# EAGLE schematic ab_v11_panel (EAGLE 6.1)
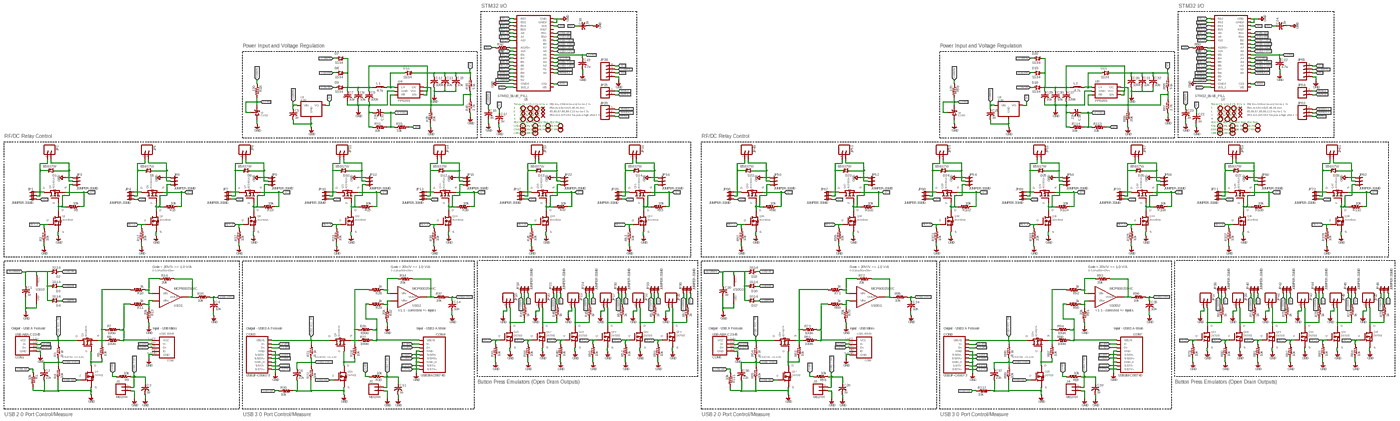
[diagram p0: schematic, sheet 1, overview]
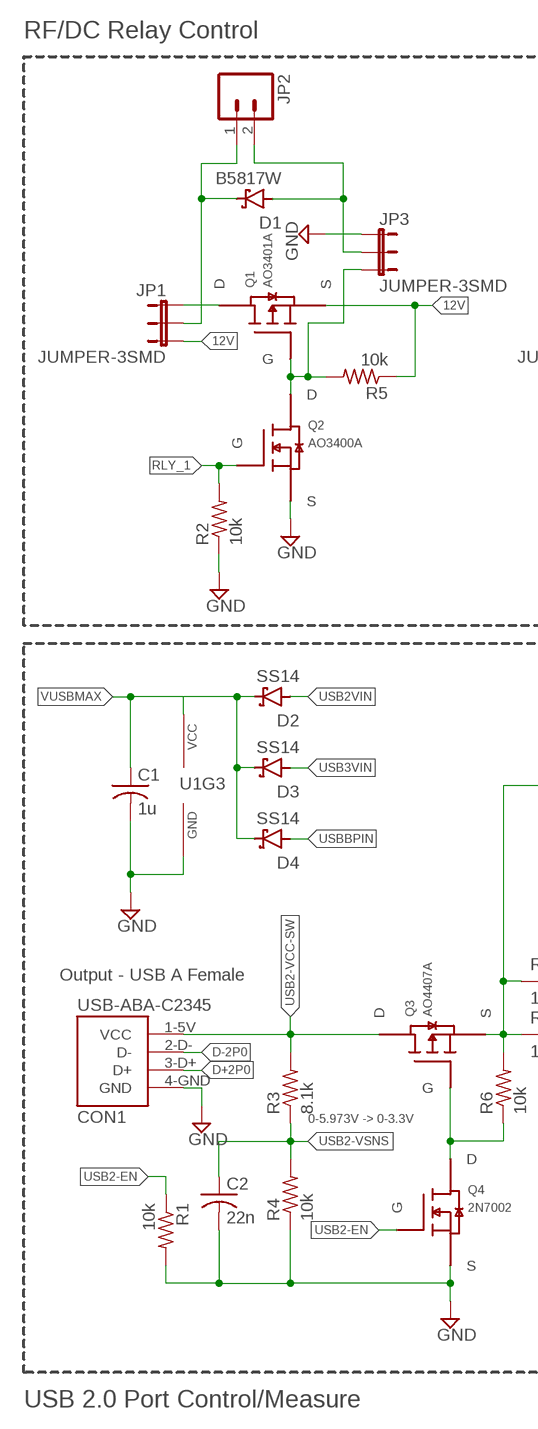
[diagram p1: schematic, sheet 1, part 1 of 4]
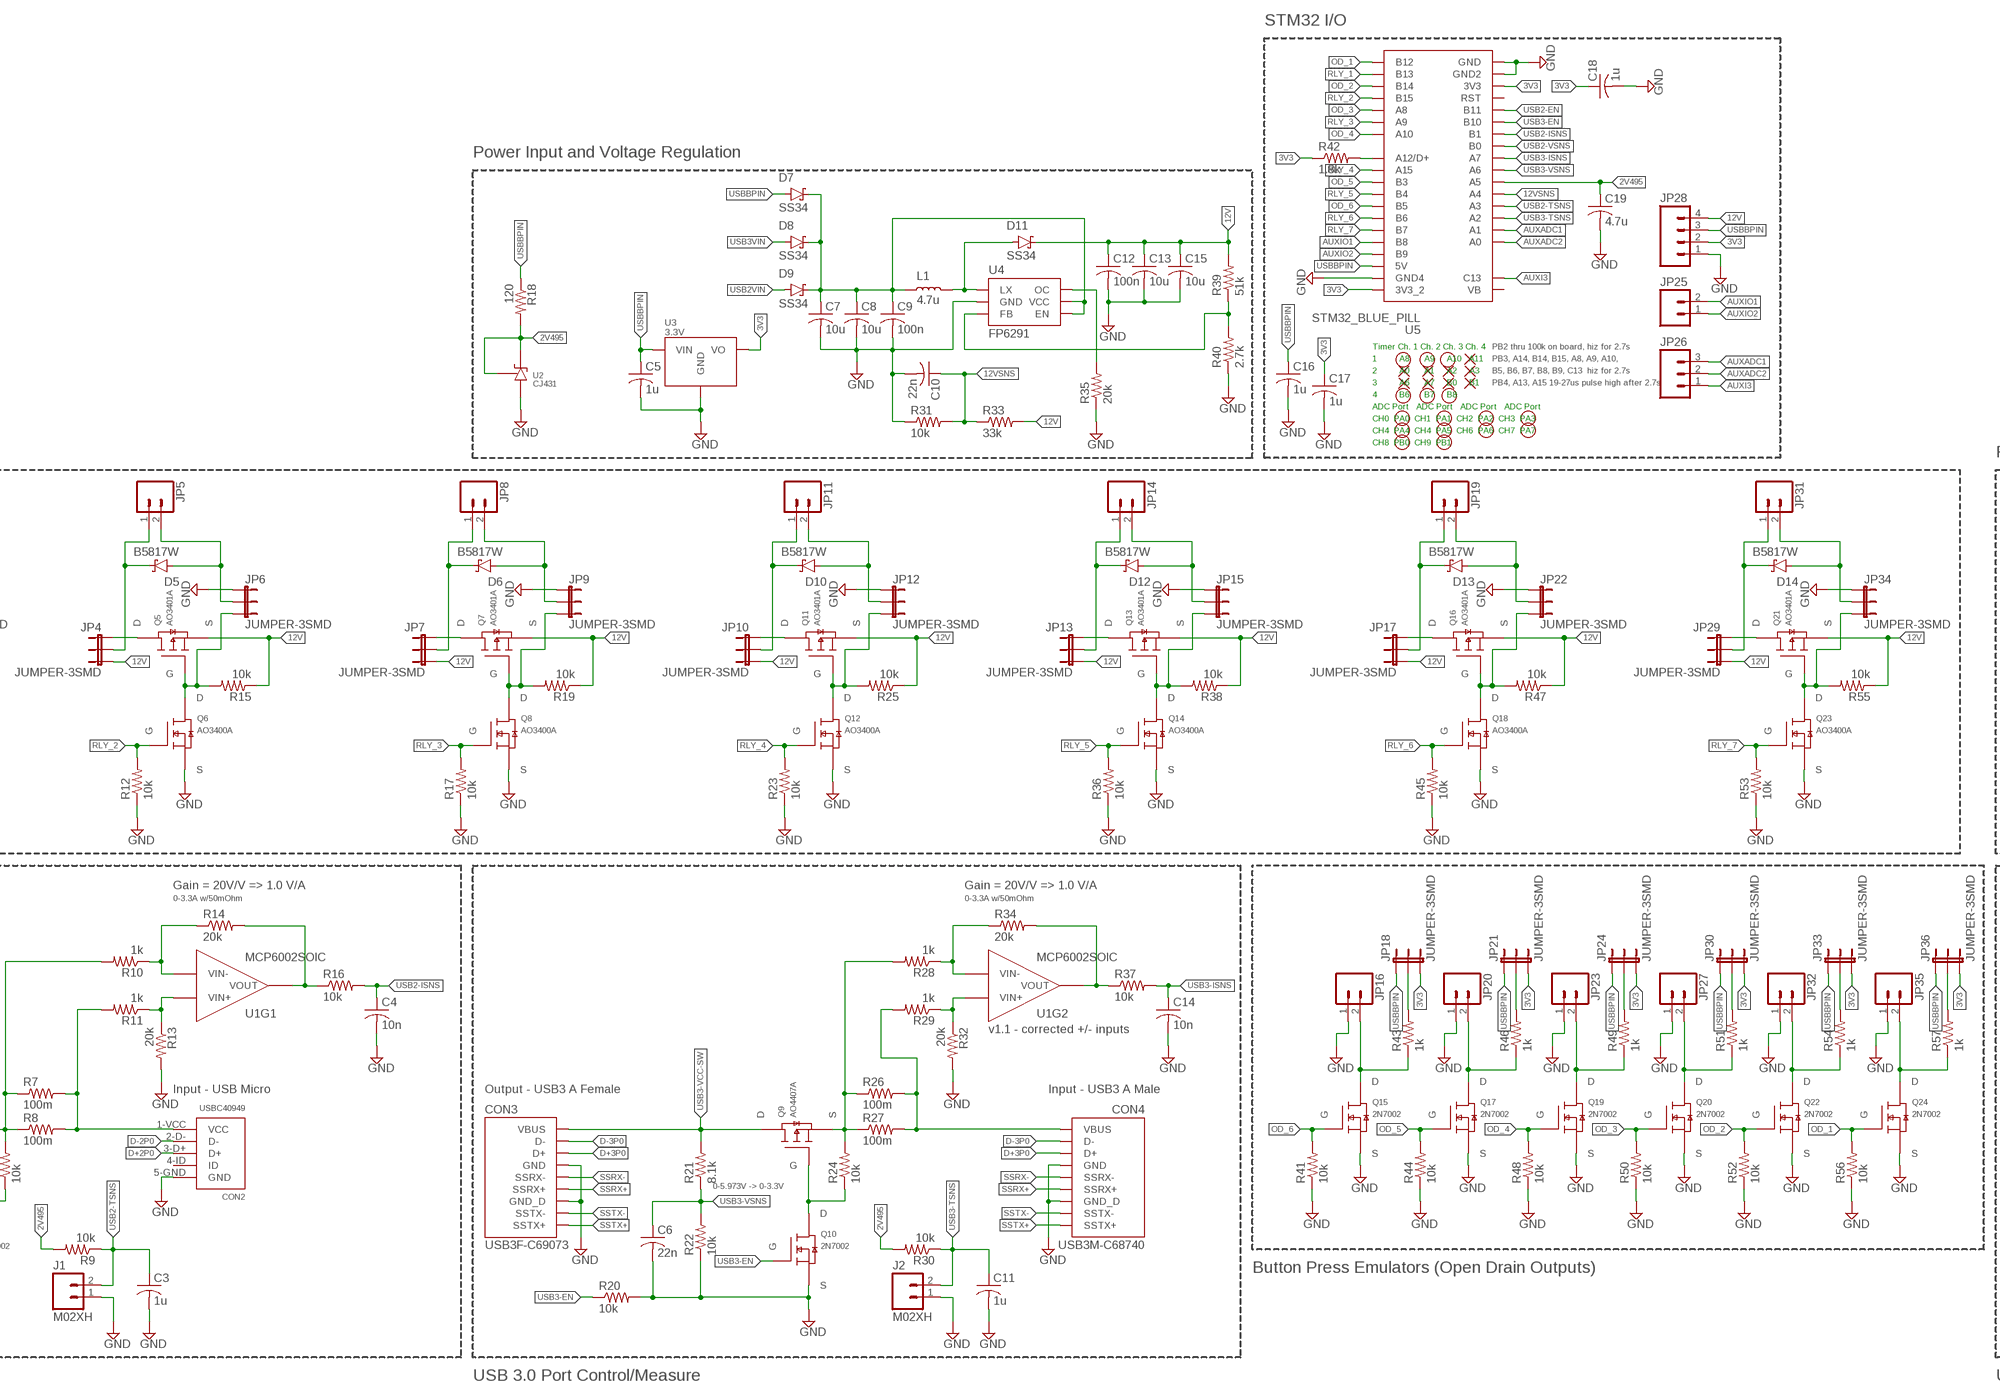
[diagram p2: schematic, sheet 1, part 2 of 4]
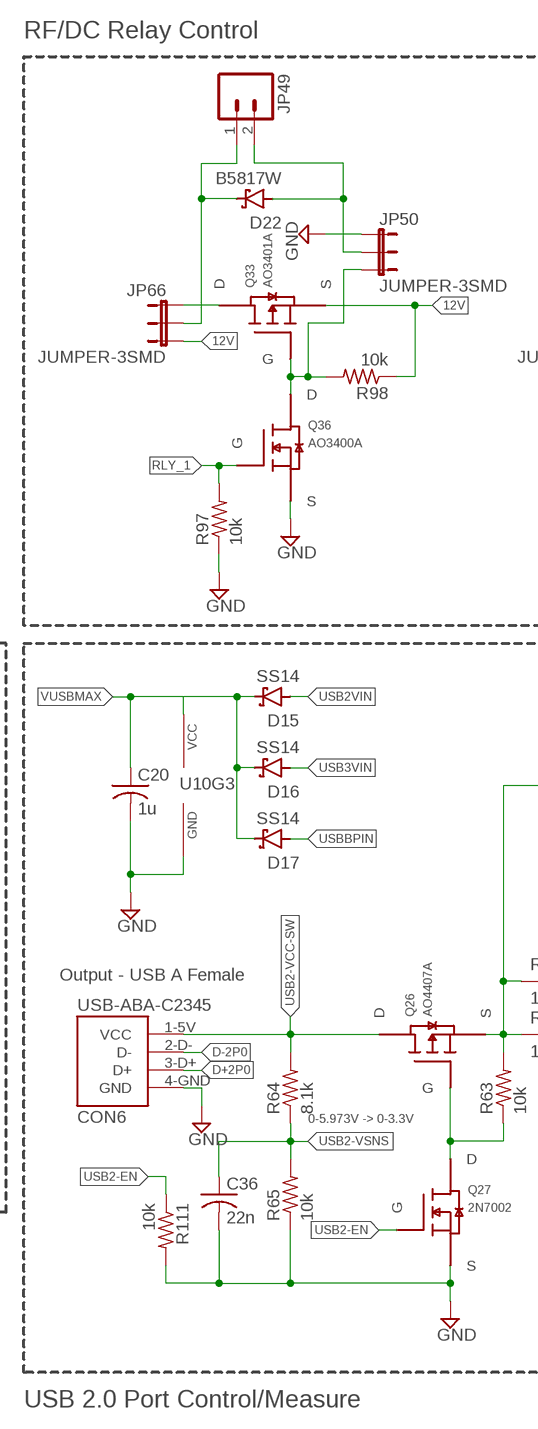
[diagram p3: schematic, sheet 1, part 3 of 4]
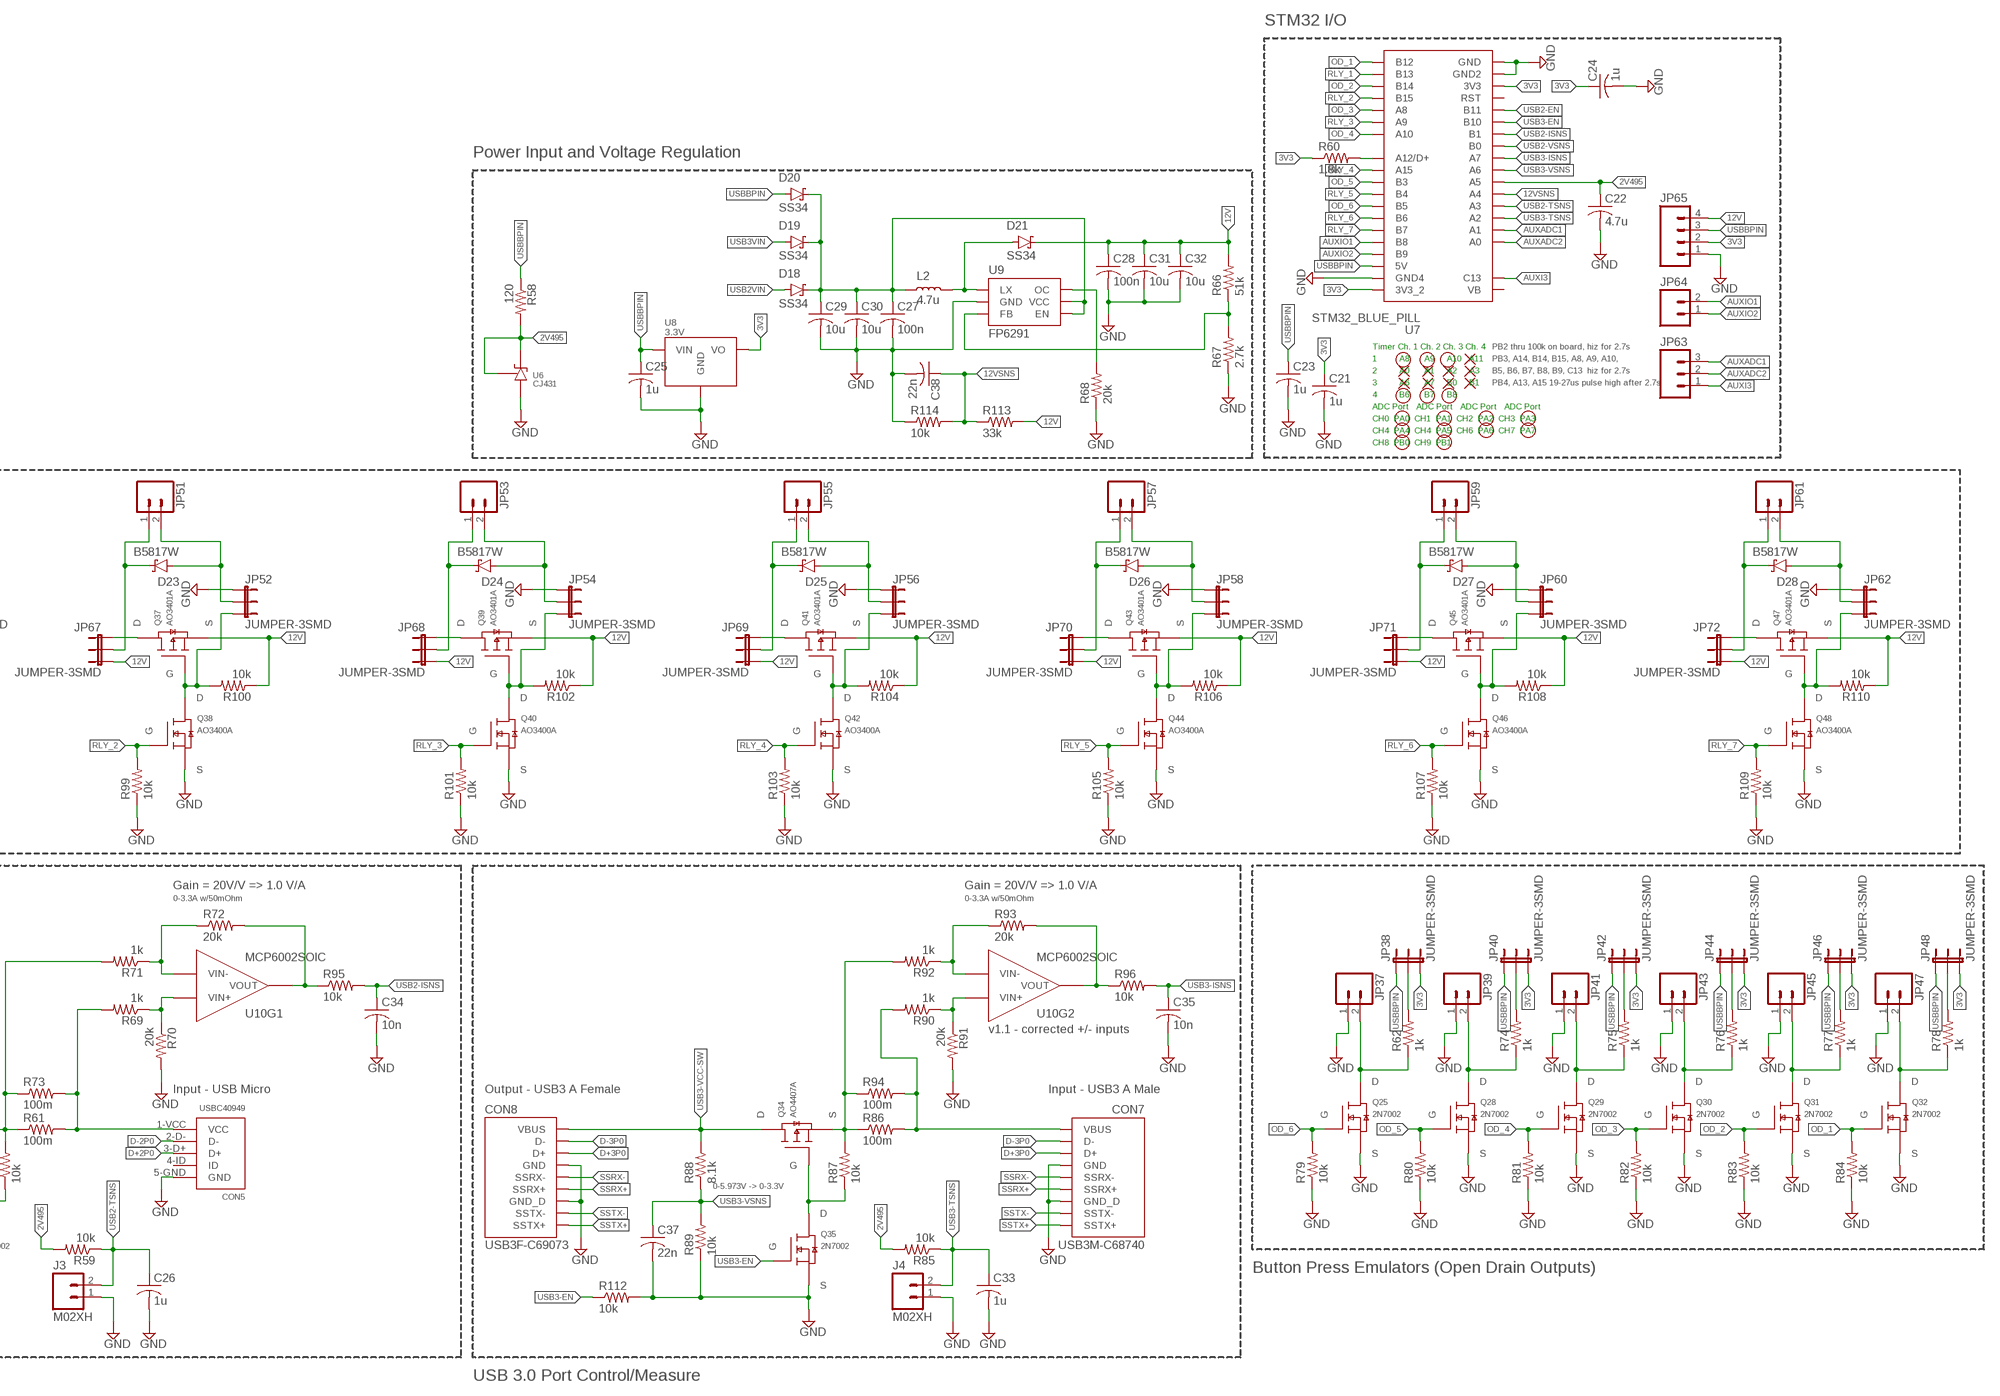
[diagram p4: schematic, sheet 1, part 4 of 4]

## Parts
C1  1u  C-USC0402  [C0402]
C2  22n  C-USC0402  [C0402]
C3  1u  C-USC0402  [C0402]
C4  10n  C-USC0402  [C0402]
C5  1u  C-USC0402  [C0402]
C6  22n  C-USC0402  [C0402]
C7  10u  C-USC0603  [C0603]
C8  10u  C-USC0603  [C0603]
C9  100n  C-USC0402  [C0402]
C10  22n  C-USC0402  [C0402]
C11  1u  C-USC0402  [C0402]
C12  100n  C-USC0402  [C0402]
C13  10u  C-USC0805  [C0805]
C14  10n  C-USC0402  [C0402]
C15  10u  C-USC0805  [C0805]
C16  1u  C-USC0402  [C0402]
C17  1u  C-USC0402  [C0402]
C18  1u  C-USC0402  [C0402]
C19  4.7u  C-USC0402  [C0402]
C20  1u  C-USC0402  [C0402]
C21  1u  C-USC0402  [C0402]
C22  4.7u  C-USC0402  [C0402]
C23  1u  C-USC0402  [C0402]
C24  1u  C-USC0402  [C0402]
C25  1u  C-USC0402  [C0402]
C26  1u  C-USC0402  [C0402]
C27  100n  C-USC0402  [C0402]
C28  100n  C-USC0402  [C0402]
C29  10u  C-USC0603  [C0603]
C30  10u  C-USC0603  [C0603]
C31  10u  C-USC0805  [C0805]
C32  10u  C-USC0805  [C0805]
C33  1u  C-USC0402  [C0402]
C34  10n  C-USC0402  [C0402]
C35  10n  C-USC0402  [C0402]
C36  22n  C-USC0402  [C0402]
C37  22n  C-USC0402  [C0402]
C38  22n  C-USC0402  [C0402]
CON1  USB-ABA-C2345  [USB_A_C2345]
CON2  USBC40949  [MICRO_USB-B_C40949]
CON3  USB3F-C69073  [USB3-F-C69073]
CON4  USB3M-C68740  [USB3-M-C68740]
CON5  USBC40949  [MICRO_USB-B_C40949]
CON6  USB-ABA-C2345  [USB_A_C2345]
CON7  USB3M-C68740  [USB3-M-C68740]
CON8  USB3F-C69073  [USB3-F-C69073]
D1  B5817W  PMEG3020ER  [SOD123W]
D2  SS14  DIODE_SCHOTTKY_SMSSMA  [SMA]
D3  SS14  DIODE_SCHOTTKY_SMSSMA  [SMA]
D4  SS14  DIODE_SCHOTTKY_SMSSMA  [SMA]
D5  B5817W  PMEG3020ER  [SOD123W]
D6  B5817W  PMEG3020ER  [SOD123W]
D7  SS34  DIODE_SCHOTTKY_SMSSMA  [SMA]
D8  SS34  DIODE_SCHOTTKY_SMSSMA  [SMA]
D9  SS34  DIODE_SCHOTTKY_SMSSMA  [SMA]
D10  B5817W  PMEG3020ER  [SOD123W]
D11  SS34  DIODE_SCHOTTKY_SMSSMA  [SMA]
D12  B5817W  PMEG3020ER  [SOD123W]
D13  B5817W  PMEG3020ER  [SOD123W]
D14  B5817W  PMEG3020ER  [SOD123W]
D15  SS14  DIODE_SCHOTTKY_SMSSMA  [SMA]
D16  SS14  DIODE_SCHOTTKY_SMSSMA  [SMA]
D17  SS14  DIODE_SCHOTTKY_SMSSMA  [SMA]
D18  SS34  DIODE_SCHOTTKY_SMSSMA  [SMA]
D19  SS34  DIODE_SCHOTTKY_SMSSMA  [SMA]
D20  SS34  DIODE_SCHOTTKY_SMSSMA  [SMA]
D21  SS34  DIODE_SCHOTTKY_SMSSMA  [SMA]
D22  B5817W  PMEG3020ER  [SOD123W]
D23  B5817W  PMEG3020ER  [SOD123W]
D24  B5817W  PMEG3020ER  [SOD123W]
D25  B5817W  PMEG3020ER  [SOD123W]
D26  B5817W  PMEG3020ER  [SOD123W]
D27  B5817W  PMEG3020ER  [SOD123W]
D28  B5817W  PMEG3020ER  [SOD123W]
J1  M02XH  [B2B-XH-A]
J2  M02XH  [B2B-XH-A]
J3  M02XH  [B2B-XH-A]
J4  M02XH  [B2B-XH-A]
JP1  JUMPER-3SMD  [SJ_3]
JP2  M02PTH  [1X02]
JP3  JUMPER-3SMD  [SJ_3]
JP4  JUMPER-3SMD  [SJ_3]
JP5  M02PTH  [1X02]
JP6  JUMPER-3SMD  [SJ_3]
JP7  JUMPER-3SMD  [SJ_3]
JP8  M02PTH  [1X02]
JP9  JUMPER-3SMD  [SJ_3]
JP10  JUMPER-3SMD  [SJ_3]
JP11  M02PTH  [1X02]
JP12  JUMPER-3SMD  [SJ_3]
JP13  JUMPER-3SMD  [SJ_3]
JP14  M02PTH  [1X02]
JP15  JUMPER-3SMD  [SJ_3]
JP16  M02PTH  [1X02]
JP17  JUMPER-3SMD  [SJ_3]
JP18  JUMPER-3SMD  [SJ_3]
JP19  M02PTH  [1X02]
JP20  M02PTH  [1X02]
JP21  JUMPER-3SMD  [SJ_3]
JP22  JUMPER-3SMD  [SJ_3]
JP23  M02PTH  [1X02]
JP24  JUMPER-3SMD  [SJ_3]
JP25  M02PTH  [1X02]
JP26  M03PTH  [1X03]
JP27  M02PTH  [1X02]
JP28  M04PTH  [1X04]
JP29  JUMPER-3SMD  [SJ_3]
JP30  JUMPER-3SMD  [SJ_3]
JP31  M02PTH  [1X02]
JP32  M02PTH  [1X02]
JP33  JUMPER-3SMD  [SJ_3]
JP34  JUMPER-3SMD  [SJ_3]
JP35  M02PTH  [1X02]
JP36  JUMPER-3SMD  [SJ_3]
JP37  M02PTH  [1X02]
JP38  JUMPER-3SMD  [SJ_3]
JP39  M02PTH  [1X02]
JP40  JUMPER-3SMD  [SJ_3]
JP41  M02PTH  [1X02]
JP42  JUMPER-3SMD  [SJ_3]
JP43  M02PTH  [1X02]
JP44  JUMPER-3SMD  [SJ_3]
JP45  M02PTH  [1X02]
JP46  JUMPER-3SMD  [SJ_3]
JP47  M02PTH  [1X02]
JP48  JUMPER-3SMD  [SJ_3]
JP49  M02PTH  [1X02]
JP50  JUMPER-3SMD  [SJ_3]
JP51  M02PTH  [1X02]
JP52  JUMPER-3SMD  [SJ_3]
JP53  M02PTH  [1X02]
JP54  JUMPER-3SMD  [SJ_3]
JP55  M02PTH  [1X02]
JP56  JUMPER-3SMD  [SJ_3]
JP57  M02PTH  [1X02]
JP58  JUMPER-3SMD  [SJ_3]
JP59  M02PTH  [1X02]
JP60  JUMPER-3SMD  [SJ_3]
JP61  M02PTH  [1X02]
JP62  JUMPER-3SMD  [SJ_3]
JP63  M03PTH  [1X03]
JP64  M02PTH  [1X02]
JP65  M04PTH  [1X04]
JP66  JUMPER-3SMD  [SJ_3]
JP67  JUMPER-3SMD  [SJ_3]
JP68  JUMPER-3SMD  [SJ_3]
JP69  JUMPER-3SMD  [SJ_3]
JP70  JUMPER-3SMD  [SJ_3]
JP71  JUMPER-3SMD  [SJ_3]
JP72  JUMPER-3SMD  [SJ_3]
L1  4.7u  INDUCTOR6X6  [INDUCTOR_6X6]
L2  4.7u  INDUCTOR6X6  [INDUCTOR_6X6]
Q1  AO3401A  [SOT23]
Q2  AO3400A  2N7002P  [SOT23]
Q3  AO4407A  P-MOSFET-SOIC8  [8-SOIC]
Q4  2N7002  2N7002P  [SOT23]
Q5  AO3401A  [SOT23]
Q6  AO3400A  2N7002P  [SOT23]
Q7  AO3401A  [SOT23]
Q8  AO3400A  2N7002P  [SOT23]
Q9  AO4407A  P-MOSFET-SOIC8  [8-SOIC]
Q10  2N7002  2N7002P  [SOT23]
Q11  AO3401A  [SOT23]
Q12  AO3400A  2N7002P  [SOT23]
Q13  AO3401A  [SOT23]
Q14  AO3400A  2N7002P  [SOT23]
Q15  2N7002  2N7002P  [SOT23]
Q16  AO3401A  [SOT23]
Q17  2N7002  2N7002P  [SOT23]
Q18  AO3400A  2N7002P  [SOT23]
Q19  2N7002  2N7002P  [SOT23]
Q20  2N7002  2N7002P  [SOT23]
Q21  AO3401A  [SOT23]
Q22  2N7002  2N7002P  [SOT23]
Q23  AO3400A  2N7002P  [SOT23]
Q24  2N7002  2N7002P  [SOT23]
Q25  2N7002  2N7002P  [SOT23]
Q26  AO4407A  P-MOSFET-SOIC8  [8-SOIC]
Q27  2N7002  2N7002P  [SOT23]
Q28  2N7002  2N7002P  [SOT23]
Q29  2N7002  2N7002P  [SOT23]
Q30  2N7002  2N7002P  [SOT23]
Q31  2N7002  2N7002P  [SOT23]
Q32  2N7002  2N7002P  [SOT23]
Q33  AO3401A  [SOT23]
Q34  AO4407A  P-MOSFET-SOIC8  [8-SOIC]
Q35  2N7002  2N7002P  [SOT23]
Q36  AO3400A  2N7002P  [SOT23]
Q37  AO3401A  [SOT23]
Q38  AO3400A  2N7002P  [SOT23]
Q39  AO3401A  [SOT23]
Q40  AO3400A  2N7002P  [SOT23]
Q41  AO3401A  [SOT23]
Q42  AO3400A  2N7002P  [SOT23]
Q43  AO3401A  [SOT23]
Q44  AO3400A  2N7002P  [SOT23]
Q45  AO3401A  [SOT23]
Q46  AO3400A  2N7002P  [SOT23]
Q47  AO3401A  [SOT23]
Q48  AO3400A  2N7002P  [SOT23]
R1  10k  R-US_R0402  [R0402]
R2  10k  R-US_R0402  [R0402]
R3  8.1k  R-US_R0402  [R0402]
R4  10k  R-US_R0402  [R0402]
R5  10k  R-US_R0402  [R0402]
R6  10k  R-US_R0402  [R0402]
R7  100m  R-US_R1206  [R1206]
R8  100m  R-US_R1206  [R1206]
R9  10k  R-US_R0402  [R0402]
R10  1k  R-US_R0402  [R0402]
R11  1k  R-US_R0402  [R0402]
R12  10k  R-US_R0402  [R0402]
R13  20k  R-US_R0402  [R0402]
R14  20k  R-US_R0402  [R0402]
R15  10k  R-US_R0402  [R0402]
R16  10k  R-US_R0402  [R0402]
R17  10k  R-US_R0402  [R0402]
R18  120  R-US_R0402  [R0402]
R19  10k  R-US_R0402  [R0402]
R20  10k  R-US_R0402  [R0402]
R21  8.1k  R-US_R0402  [R0402]
R22  10k  R-US_R0402  [R0402]
R23  10k  R-US_R0402  [R0402]
R24  10k  R-US_R0402  [R0402]
R25  10k  R-US_R0402  [R0402]
R26  100m  R-US_R1206  [R1206]
R27  100m  R-US_R1206  [R1206]
R28  1k  R-US_R0402  [R0402]
R29  1k  R-US_R0402  [R0402]
R30  10k  R-US_R0402  [R0402]
R31  10k  R-US_R0402  [R0402]
R32  20k  R-US_R0402  [R0402]
R33  33k  R-US_R0402  [R0402]
R34  20k  R-US_R0402  [R0402]
R35  20k  R-US_R0402  [R0402]
R36  10k  R-US_R0402  [R0402]
R37  10k  R-US_R0402  [R0402]
R38  10k  R-US_R0402  [R0402]
R39  51k  R-US_R0402  [R0402]
R40  2.7k  R-US_R0402  [R0402]
R41  10k  R-US_R0402  [R0402]
R42  1.8k  R-US_R0402  [R0402]
R43  1k  R-US_R0402  [R0402]
R44  10k  R-US_R0402  [R0402]
R45  10k  R-US_R0402  [R0402]
R46  1k  R-US_R0402  [R0402]
R47  10k  R-US_R0402  [R0402]
R48  10k  R-US_R0402  [R0402]
R49  1k  R-US_R0402  [R0402]
R50  10k  R-US_R0402  [R0402]
R51  1k  R-US_R0402  [R0402]
R52  10k  R-US_R0402  [R0402]
R53  10k  R-US_R0402  [R0402]
R54  1k  R-US_R0402  [R0402]
R55  10k  R-US_R0402  [R0402]
R56  10k  R-US_R0402  [R0402]
R57  1k  R-US_R0402  [R0402]
R58  120  R-US_R0402  [R0402]
R59  10k  R-US_R0402  [R0402]
R60  1.8k  R-US_R0402  [R0402]
R61  100m  R-US_R1206  [R1206]
R62  1k  R-US_R0402  [R0402]
R63  10k  R-US_R0402  [R0402]
R64  8.1k  R-US_R0402  [R0402]
R65  10k  R-US_R0402  [R0402]
R66  51k  R-US_R0402  [R0402]
R67  2.7k  R-US_R0402  [R0402]
R68  20k  R-US_R0402  [R0402]
R69  1k  R-US_R0402  [R0402]
R70  20k  R-US_R0402  [R0402]
R71  1k  R-US_R0402  [R0402]
R72  20k  R-US_R0402  [R0402]
R73  100m  R-US_R1206  [R1206]
R74  1k  R-US_R0402  [R0402]
R75  1k  R-US_R0402  [R0402]
R76  1k  R-US_R0402  [R0402]
R77  1k  R-US_R0402  [R0402]
R78  1k  R-US_R0402  [R0402]
R79  10k  R-US_R0402  [R0402]
R80  10k  R-US_R0402  [R0402]
R81  10k  R-US_R0402  [R0402]
R82  10k  R-US_R0402  [R0402]
R83  10k  R-US_R0402  [R0402]
R84  10k  R-US_R0402  [R0402]
R85  10k  R-US_R0402  [R0402]
R86  100m  R-US_R1206  [R1206]
R87  10k  R-US_R0402  [R0402]
R88  8.1k  R-US_R0402  [R0402]
R89  10k  R-US_R0402  [R0402]
R90  1k  R-US_R0402  [R0402]
R91  20k  R-US_R0402  [R0402]
R92  1k  R-US_R0402  [R0402]
R93  20k  R-US_R0402  [R0402]
R94  100m  R-US_R1206  [R1206]
R95  10k  R-US_R0402  [R0402]
R96  10k  R-US_R0402  [R0402]
R97  10k  R-US_R0402  [R0402]
R98  10k  R-US_R0402  [R0402]
R99  10k  R-US_R0402  [R0402]
R100  10k  R-US_R0402  [R0402]
R101  10k  R-US_R0402  [R0402]
R102  10k  R-US_R0402  [R0402]
R103  10k  R-US_R0402  [R0402]
R104  10k  R-US_R0402  [R0402]
R105  10k  R-US_R0402  [R0402]
R106  10k  R-US_R0402  [R0402]
R107  10k  R-US_R0402  [R0402]
R108  10k  R-US_R0402  [R0402]
R109  10k  R-US_R0402  [R0402]
R110  10k  R-US_R0402  [R0402]
R111  10k  R-US_R0402  [R0402]
R112  10k  R-US_R0402  [R0402]
R113  33k  R-US_R0402  [R0402]
R114  10k  R-US_R0402  [R0402]
U1  MCP6002SOIC  [8-SOIC]
U2  CJ431  TL431SOT23  [SOT23]
U3  3.3V  AP1117UR133-B  [SOT-89]
U4  FP6291  [SOT23-6]
U5  STM32_BLUE_PILL  [STM32_BLUE_PILL_USABLE]
U6  CJ431  TL431SOT23  [SOT23]
U7  STM32_BLUE_PILL  [STM32_BLUE_PILL_USABLE]
U8  3.3V  AP1117UR133-B  [SOT-89]
U9  FP6291  [SOT23-6]
U10  MCP6002SOIC  [8-SOIC]

## Nets
2V495: C19.1 C22.1 R9.2 R18.2 R30.2 R58.2 R59.2 R85.2 U2.1(K) U2.2(REF) U5.A5 U6.1(K) U6.2(REF) U7.A5
3V3: C17.1 C18.1 C21.1 C24.1 JP18.3 JP21.3 JP24.3 JP28.2 JP30.3 JP33.3 JP36.3 JP38.3 JP40.3 JP42.3 JP44.3 JP46.3 JP48.3 JP65.2 R42.1 R60.1 U3.1(VO) U5.3V3 U5.3V3_2 U7.3V3 U7.3V3_2 U8.1(VO)
12V: C12.1 C13.1 C15.1 C28.1 C31.1 C32.1 D11.K(CATHODE) D21.K(CATHODE) JP1.3 JP4.3 JP7.3 JP10.3 JP13.3 JP17.3 JP28.4 JP29.3 JP65.4 JP66.3 JP67.3 JP68.3 JP69.3 JP70.3 JP71.3 JP72.3 Q1.2(S) Q5.2(S) Q7.2(S) Q11.2(S) Q13.2(S) Q16.2(S) Q21.2(S) Q33.2(S) Q37.2(S) Q39.2(S) Q41.2(S) Q43.2(S) Q45.2(S) Q47.2(S) R5.1 R15.1 R19.1 R25.1 R33.2 R38.1 R39.2 R47.1 R55.1 R66.2 R98.1 R100.1 R102.1 R104.1 R106.1 R108.1 R110.1 R113.2
12VSNS: C10.1 C38.1 R31.2 R33.1 R113.1 R114.2 U5.A4 U7.A4
AUXADC1: JP26.3 JP63.3 U5.A1 U7.A1
AUXADC2: JP26.2 JP63.2 U5.A0 U7.A0
AUXI3: JP26.1 JP63.1 U5.C13 U7.C13
AUXIO1: JP25.2 JP64.2 U5.B8 U7.B8
AUXIO2: JP25.1 JP64.1 U5.B9 U7.B9
BOOSTVCC: C7.1 C8.1 C9.1 D7.K(CATHODE) D8.K(CATHODE) D9.K(CATHODE) L1.1 U4.4(EN) U4.5(VCC)
BOOSTVCC1: C27.1 C29.1 C30.1 D18.K(CATHODE) D19.K(CATHODE) D20.K(CATHODE) L2.1 U9.4(EN) U9.5(VCC)
D+2P0: CON1.3-D+(D+) CON2.3-D+(D+) CON5.3-D+(D+) CON6.3-D+(D+)
D+3P0: CON3.3-D+(D+) CON4.3-D+(D+) CON7.3-D+(D+) CON8.3-D+(D+)
D-2P0: CON1.2-D-(D-) CON2.2-D-(D-) CON5.2-D-(D-) CON6.2-D-(D-)
D-3P0: CON3.2-D-(D-) CON4.2-D-(D-) CON7.2-D-(D-) CON8.2-D-(D-)
FB: R39.1 R40.2 U4.3(FB)
FB1: R66.1 R67.2 U9.3(FB)
GND: C1.2 C2.2 C3.2 C4.2 C5.2 C6.2 C7.2 C8.2 C9.2 C10.2 C11.2 C12.2 C13.2 C14.2 C15.2 C16.2 C17.2 C18.2 C19.2 C20.2 C21.2 C22.2 C23.2 C24.2 C25.2 C26.2 C27.2 C28.2 C29.2 C30.2 C31.2 C32.2 C33.2 C34.2 C35.2 C36.2 C37.2 C38.2 CON1.4-GND(GND) CON2.5-GND(GND) CON3.4-GND(GND) CON3.7-GND(GND_D) CON4.4-GND(GND) CON4.7-GNDD(GND_D) CON5.5-GND(GND) CON6.4-GND(GND) CON7.4-GND(GND) CON7.7-GNDD(GND_D) CON8.4-GND(GND) CON8.7-GND(GND_D) J1.1 J2.1 J3.1 J4.1 JP3.1 JP6.1 JP9.1 JP12.1 JP15.1 JP16.1 JP20.1 JP22.1 JP23.1 JP27.1 JP28.1 JP32.1 JP34.1 JP35.1 JP37.1 JP39.1 JP41.1 JP43.1 JP45.1 JP47.1 JP50.1 JP52.1 JP54.1 JP56.1 JP58.1 JP60.1 JP62.1 JP65.1 Q2.2(S) Q4.2(S) Q6.2(S) Q8.2(S) Q10.2(S) Q12.2(S) Q14.2(S) Q15.2(S) Q17.2(S) Q18.2(S) Q19.2(S) Q20.2(S) Q22.2(S) Q23.2(S) Q24.2(S) Q25.2(S) Q27.2(S) Q28.2(S) Q29.2(S) Q30.2(S) Q31.2(S) Q32.2(S) Q35.2(S) Q36.2(S) Q38.2(S) Q40.2(S) Q42.2(S) Q44.2(S) Q46.2(S) Q48.2(S) R1.2 R2.1 R4.1 R12.1 R13.2 R17.1 R20.2 R22.1 R23.1 R31.1 R32.2 R35.1 R36.1 R40.1 R41.1 R44.1 R45.1 R48.1 R50.1 R52.1 R53.1 R56.1 R65.1 R67.1 R68.1 R70.2 R79.1 R80.1 R81.1 R82.1 R83.1 R84.1 R89.1 R91.2 R97.1 R99.1 R101.1 R103.1 R105.1 R107.1 R109.1 R111.2 R112.2 R114.1 U1.4(GND) U2.3(A) U3.2(GND) U3.2@1(GND) U4.2(GND) U5.GND U5.GND2 U5.GND4 U6.3(A) U7.GND U7.GND2 U7.GND4 U8.2(GND) U8.2@1(GND) U9.2(GND) U10.4(GND)
N$1: JP16.2 Q15.3(D) R43.1
N$2: Q9.4(G) Q10.3(D) R24.1
N$3: R10.1 R14.1 U1.2(VIN-)
N$4: R11.1 R13.1 U1.3(VIN+)
N$5: JP21.2 R46.2
N$6: JP18.2 R43.2
N$7: Q3.4(G) Q4.3(D) R6.1
N$8: JP20.2 Q17.3(D) R46.1
N$9: JP24.2 R49.2
N$10: JP23.2 Q19.3(D) R49.1
N$11: JP30.2 R51.2
N$12: JP27.2 Q20.3(D) R51.1
N$13: JP33.2 R54.2
N$14: JP32.2 Q22.3(D) R54.1
N$15: JP36.2 R57.2
N$16: R28.1 R34.1 U1.6(VIN-)
N$17: R29.1 R32.1 U1.5(VIN+)
N$18: JP35.2 Q24.3(D) R57.1
N$19: R60.2 U7.A12(A12/D+)
N$20: JP6.3 Q5.1(G) Q6.3(D) R15.2
N$21: JP38.2 R62.2
N$22: Q26.4(G) Q27.3(D) R63.1
N$23: R71.1 R72.1 U10.2(VIN-)
N$24: R69.1 R70.1 U10.3(VIN+)
N$25: JP37.2 Q25.3(D) R62.1
N$26: R42.2 U5.A12(A12/D+)
N$27: JP40.2 R74.2
N$28: JP39.2 Q28.3(D) R74.1
N$29: JP42.2 R75.2
N$30: JP41.2 Q29.3(D) R75.1
N$31: JP44.2 R76.2
N$32: JP43.2 Q30.3(D) R76.1
N$33: JP46.2 R77.2
N$34: JP45.2 Q31.3(D) R77.1
N$35: JP48.2 R78.2
N$36: JP47.2 Q32.3(D) R78.1
N$37: Q34.4(G) Q35.3(D) R87.1
N$38: R92.1 R93.1 U10.6(VIN-)
N$39: R90.1 R91.1 U10.5(VIN+)
N$40: JP52.3 Q37.1(G) Q38.3(D) R100.2
OC: R35.2 U4.6(OC)
OC1: R68.2 U9.6(OC)
OD_1: Q24.1(G) Q32.1(G) R56.2 R84.2 U5.B12 U7.B12
OD_2: Q22.1(G) Q31.1(G) R52.2 R83.2 U5.B14 U7.B14
OD_3: Q20.1(G) Q30.1(G) R50.2 R82.2 U5.A8 U7.A8
OD_4: Q19.1(G) Q29.1(G) R48.2 R81.2 U5.A10 U7.A10
OD_5: Q17.1(G) Q28.1(G) R44.2 R80.2 U5.B3 U7.B3
OD_6: Q15.1(G) Q25.1(G) R41.2 R79.2 U5.B5 U7.B5
RLY1-SW: D1.K(CATHODE) JP1.2 JP2.1
RLY1-SW1: D5.K(CATHODE) JP4.2 JP5.1
RLY1-SW2: D6.K(CATHODE) JP7.2 JP8.1
RLY1-SW3: D10.K(CATHODE) JP10.2 JP11.1
RLY1-SW4: D12.K(CATHODE) JP13.2 JP14.1
RLY1-SW5: D13.K(CATHODE) JP17.2 JP19.1
RLY1-SW6: D14.K(CATHODE) JP29.2 JP31.1
RLY1-SW7: D22.K(CATHODE) JP49.1 JP66.2
RLY1-SW8: D23.K(CATHODE) JP51.1 JP67.2
RLY1-SW9: D24.K(CATHODE) JP53.1 JP68.2
RLY1-SW10: D25.K(CATHODE) JP55.1 JP69.2
RLY1-SW11: D26.K(CATHODE) JP57.1 JP70.2
RLY1-SW12: D27.K(CATHODE) JP59.1 JP71.2
RLY1-SW13: D28.K(CATHODE) JP61.1 JP72.2
RLY1D: JP1.1 Q1.3(D)
RLY1D1: JP4.1 Q5.3(D)
RLY1D2: JP7.1 Q7.3(D)
RLY1D3: JP10.1 Q11.3(D)
RLY1D4: JP13.1 Q13.3(D)
RLY1D5: JP17.1 Q16.3(D)
RLY1D6: JP29.1 Q21.3(D)
RLY1D7: JP66.1 Q33.3(D)
RLY1D8: JP67.1 Q37.3(D)
RLY1D9: JP68.1 Q39.3(D)
RLY1D10: JP69.1 Q41.3(D)
RLY1D11: JP70.1 Q43.3(D)
RLY1D12: JP71.1 Q45.3(D)
RLY1D13: JP72.1 Q47.3(D)
RLY1DG: JP3.3 Q1.1(G) Q2.3(D) R5.2
RLY1DG1: JP50.3 Q33.1(G) Q36.3(D) R98.2
RLY1DG2: JP9.3 Q7.1(G) Q8.3(D) R19.2
RLY1DG3: JP12.3 Q11.1(G) Q12.3(D) R25.2
RLY1DG4: JP15.3 Q13.1(G) Q14.3(D) R38.2
RLY1DG5: JP22.3 Q16.1(G) Q18.3(D) R47.2
RLY1DG6: JP34.3 Q21.1(G) Q23.3(D) R55.2
RLY1DG7: JP54.3 Q39.1(G) Q40.3(D) R102.2
RLY1DG8: JP56.3 Q41.1(G) Q42.3(D) R104.2
RLY1DG9: JP58.3 Q43.1(G) Q44.3(D) R106.2
RLY1DG10: JP60.3 Q45.1(G) Q46.3(D) R108.2
RLY1DG11: JP62.3 Q47.1(G) Q48.3(D) R110.2
RLY1SPLY: D1.A(ANODE) JP2.2 JP3.2
RLY1SPLY1: D5.A(ANODE) JP5.2 JP6.2
RLY1SPLY2: D6.A(ANODE) JP8.2 JP9.2
RLY1SPLY3: D10.A(ANODE) JP11.2 JP12.2
RLY1SPLY4: D12.A(ANODE) JP14.2 JP15.2
RLY1SPLY5: D13.A(ANODE) JP19.2 JP22.2
RLY1SPLY6: D14.A(ANODE) JP31.2 JP34.2
RLY1SPLY7: D22.A(ANODE) JP49.2 JP50.2
RLY1SPLY8: D23.A(ANODE) JP51.2 JP52.2
RLY1SPLY9: D24.A(ANODE) JP53.2 JP54.2
RLY1SPLY10: D25.A(ANODE) JP55.2 JP56.2
RLY1SPLY11: D26.A(ANODE) JP57.2 JP58.2
RLY1SPLY12: D27.A(ANODE) JP59.2 JP60.2
RLY1SPLY13: D28.A(ANODE) JP61.2 JP62.2
RLY_1: Q2.1(G) Q36.1(G) R2.2 R97.2 U5.B13 U7.B13
RLY_2: Q6.1(G) Q38.1(G) R12.2 R99.2 U5.B15 U7.B15
RLY_3: Q8.1(G) Q40.1(G) R17.2 R101.2 U5.A9 U7.A9
RLY_4: Q12.1(G) Q42.1(G) R23.2 R103.2 U5.A15 U7.A15
RLY_5: Q14.1(G) Q44.1(G) R36.2 R105.2 U5.B4 U7.B4
RLY_6: Q18.1(G) Q46.1(G) R45.2 R107.2 U5.B6 U7.B6
RLY_7: Q23.1(G) Q48.1(G) R53.2 R109.2 U5.B7 U7.B7
SSRX+: CON3.6-SSRX+(SSRX+) CON4.6-SSRX+(SSRX+) CON7.6-SSRX+(SSRX+) CON8.6-SSRX+(SSRX+)
SSRX-: CON3.5-SSRX-(SSRX-) CON4.5-SSRX-(SSRX-) CON7.5-SSRX-(SSRX-) CON8.5-SSRX-(SSRX-)
SSTX+: CON3.9-SSTX+(SSTX+) CON4.9-SSTX+(SSTX+) CON7.9-SSTX+(SSTX+) CON8.9-SSTX+(SSTX+)
SSTX-: CON3.8-SSTX-(SSTX-) CON4.8-SSTX-(SSTX-) CON7.8-SSTX-(SSTX-) CON8.8-SSTX-(SSTX-)
SW: D11.A(ANODE) L1.2 U4.1(LX)
SW1: D21.A(ANODE) L2.2 U9.1(LX)
USB2-EN: Q4.1(G) Q27.1(G) R1.1 R111.1 U5.B11 U7.B11
USB2-ISNS: C4.1 C34.1 R16.2 R95.2 U5.B1 U7.B1
USB2-ISNS-R: R14.2 R16.1 U1.1(VOUT)
USB2-ISNS-R1: R72.2 R95.1 U10.1(VOUT)
USB2-TSNS: C3.1 C26.1 J1.2 J3.2 R9.1 R59.1 U5.A3 U7.A3
USB2-VCC-SW: CON1.1-5V(VCC) CON6.1-5V(VCC) Q3.5(D) Q3.6(D) Q3.7(D) Q3.8(D) Q26.5(D) Q26.6(D) Q26.7(D) Q26.8(D) R3.2 R64.2
USB2-VSNS: C2.1 C36.1 R3.1 R4.2 R64.1 R65.2 U5.B0 U7.B0
USB2VIN: CON2.1-VCC(VCC) CON5.1-VCC(VCC) D2.A(ANODE) D9.A(ANODE) D15.A(ANODE) D18.A(ANODE) R7.2 R8.2 R11.2 R61.2 R69.2 R73.2
USB3-EN: Q10.1(G) Q35.1(G) R20.1 R112.1 U5.B10 U7.B10
USB3-ISNS: C14.1 C35.1 R37.2 R96.2 U5.A7 U7.A7
USB3-ISNS-R: R34.2 R37.1 U1.7(VOUT)
USB3-ISNS-R1: R93.2 R96.1 U10.7(VOUT)
USB3-TSNS: C11.1 C33.1 J2.2 J4.2 R30.1 R85.1 U5.A2 U7.A2
USB3-VCC-SW: CON3.1-VBUS(VBUS) CON8.1-VBUS(VBUS) Q9.5(D) Q9.6(D) Q9.7(D) Q9.8(D) Q34.5(D) Q34.6(D) Q34.7(D) Q34.8(D) R21.2 R88.2
USB3-VSNS: C6.1 C37.1 R21.1 R22.2 R88.1 R89.2 U5.A6 U7.A6
USB3OUTVCC: Q9.1(S) Q9.2(S) Q9.3(S) R24.2 R26.1 R27.1 R28.2
USB3OUTVCC1: Q34.1(S) Q34.2(S) Q34.3(S) R86.1 R87.2 R92.2 R94.1
USB3VIN: CON4.1-VBUS(VBUS) CON7.1-VBUS(VBUS) D3.A(ANODE) D8.A(ANODE) D16.A(ANODE) D19.A(ANODE) R26.2 R27.2 R29.2 R86.2 R90.2 R94.2
USBBPIN: C5.1 C16.1 C23.1 C25.1 D4.A(ANODE) D7.A(ANODE) D17.A(ANODE) D20.A(ANODE) JP18.1 JP21.1 JP24.1 JP28.3 JP30.1 JP33.1 JP36.1 JP38.1 JP40.1 JP42.1 JP44.1 JP46.1 JP48.1 JP65.3 R18.1 R58.1 U3.3(VIN) U5.5V U7.5V U8.3(VIN)
USBOUTVCC: Q3.1(S) Q3.2(S) Q3.3(S) R6.2 R7.1 R8.1 R10.2
USBOUTVCC1: Q26.1(S) Q26.2(S) Q26.3(S) R61.1 R63.2 R71.2 R73.1
VUSBMAX: C1.1 C20.1 D2.K(CATHODE) D3.K(CATHODE) D4.K(CATHODE) D15.K(CATHODE) D16.K(CATHODE) D17.K(CATHODE) U1.8(VCC) U10.8(VCC)
Unconnected: CON2.4-ID(ID) CON5.4-ID(ID) U5.RST U5.VBAT(VB) U7.RST U7.VBAT(VB)

## Notes on the sheet
- STM32 I/O | STM32 I/O
- Power Input and Voltage Regulation | Power Input and Voltage Regulation
- Timer Ch. 1 Ch. 2 Ch. 3 Ch. 4 | PB2 thru 100k on board, hiz for 2.7s | Timer Ch. 1 Ch. 2 Ch. 3 Ch. 4 | PB2 thru 100k on board, hiz for 2.7s
- 1         A8      A9     A10   A11 | PB3, A14, B14, B15, A8, A9, A10, | 1         A8      A9     A10   A11 | PB3, A14, B14, B15, A8, A9, A10,
- 2         A0      A1     A2     A3 | B5, B6, B7, B8, B9, C13  hiz for 2.7s | 2         A0      A1     A2     A3 | B5, B6, B7, B8, B9, C13  hiz for 2.7s
- 3         A6      A7     B0     B1 | PB4, A13, A15 19-27us pulse high after 2.7s | 3         A6      A7     B0     B1 | PB4, A13, A15 19-27us pulse high after 2.7s
- 4         B6      B7     B8 | 4         B6      B7     B8
- ADC Port   ADC Port   ADC Port   ADC Port | ADC Port   ADC Port   ADC Port   ADC Port
- CH0  PA0  CH1  PA1  CH2  PA2  CH3  PA3 | CH0  PA0  CH1  PA1  CH2  PA2  CH3  PA3
- CH4  PA4  CH4  PA5  CH6  PA6  CH7  PA7 | CH4  PA4  CH4  PA5  CH6  PA6  CH7  PA7
- CH8  PB0  CH9  PB1 | CH8  PB0  CH9  PB1
- RF/DC Relay Control | RF/DC Relay Control
- Gain = 20V/V => 1.0 V/A | Gain = 20V/V => 1.0 V/A | Gain = 20V/V => 1.0 V/A | Gain = 20V/V => 1.0 V/A
- 0-3.3A w/50mOhm | 0-3.3A w/50mOhm | 0-3.3A w/50mOhm | 0-3.3A w/50mOhm
- v1.1 - corrected +/- inputs | v1.1 - corrected +/- inputs
- Output - USB A Female | Input - USB Micro | Output - USB3 A Female | Input - USB3 A Male | Output - USB A Female | Input - USB Micro | Output - USB3 A Female | Input - USB3 A Male
- 0-5.973V -> 0-3.3V | 0-5.973V -> 0-3.3V | 0-5.973V -> 0-3.3V | 0-5.973V -> 0-3.3V
- Button Press Emulators (Open Drain Outputs) | Button Press Emulators (Open Drain Outputs)
- USB 2.0 Port Control/Measure | USB 3.0 Port Control/Measure | USB 2.0 Port Control/Measure | USB 3.0 Port Control/Measure

## Library data of the parts
C1-C38 = resistor:C-US: CAPACITOR, American symbol
CON1 CON6 = custom:USB-AB
CON2 CON5 = custom:USB
CON3 CON4 CON7 CON8 = custom:USB3
D1 D5 D6 D10 D12-D14 D22-D28 = custom:PMEG3020ER: Schottky Diode 30V 2A 0.42V 1.5mA Leakage
D2-D4 D7-D9 D11 D15-D21 = custom:DIODE_SCHOTTKY_SMS
J1-J4 = custom:M02: 2-pin Header
JP1 JP3 JP4 JP6 JP7 JP9 JP10 JP12 JP13 JP15 JP17 JP18 JP21 JP22 JP24 JP29 JP30 JP33 JP34 JP36 JP38 JP40 JP42 JP44 JP46 JP48 JP50 JP52 JP54 JP56 JP58 JP60 JP62 JP66-JP72 = SparkFun:JUMPER-3
JP2 JP5 JP8 JP11 JP14 JP16 JP19 JP20 JP23 JP25 JP27 JP31 JP32 JP35 JP37 JP39 JP41 JP43 JP45 JP47 JP49 JP51 JP53 JP55 JP57 JP59 JP61 JP64 = SparkFun:M02: Header 2 Standard 2-pin 0.1" header. Use with straight break away headers (SKU : PRT-00116), right angle break away headers (PRT-00553), swiss pins (PRT-00743), machine pins (PRT-00117), and female headers (PRT-00115). Molex polarized connector foot print use with SKU : PRT-08233 with associated crimp pins and housings.
JP26 JP63 = SparkFun:M03: Header 3 Standard 3-pin 0.1" header. Use with straight break away headers (SKU : PRT-00116), right angle break away headers (PRT-00553), swiss pins (PRT-00743), machine pins (PRT-00117), and female headers (PRT-00115). Molex polarized connector foot print use with SKU : PRT-08232 with associated crimp pins and housings.
JP28 JP65 = SparkFun:M04: Header 4 Standard 4-pin 0.1" header. Use with straight break away headers (SKU : PRT-00116), right angle break away headers (PRT-00553), swiss pins (PRT-00743), machine pins (PRT-00117), and female headers (PRT-00115). Molex polarized connector foot print use with SKU : PRT-08231 with associated crimp pins and housings. 1MM SMD Version SKU: PRT-10208
L1 L2 = custom:INDUCTOR
Q1 Q5 Q7 Q11 Q13 Q16 Q21 Q33 Q37 Q39 Q41 Q43 Q45 Q47 = custom:AO3401A: P-Channel MOSFET 30V 4A Logic Level 2.5V 44mOhm
Q2 Q4 Q6 Q8 Q10 Q12 Q14 Q15 Q17-Q20 Q22-Q25 Q27-Q32 Q35 Q36 Q38 Q40 Q42 Q44 Q46 Q48 = custom:2N7002P: 2N7002P N-channel MOSFET 60V 360mA Logic Level
Q3 Q9 Q26 Q34 = custom:P-MOSFET-SOIC8
R1-R114 = resistor:R-US_: RESISTOR, American symbol
U1 U10 = custom:MCP6002: Op-Amp Dual Rail-to-Rail 1MHz
U2 U6 = custom:TL431: Shunt Voltage Reference IC 700uA 100mA 36V
U3 U8 = custom:AP1117: Linear Voltage Regulator 18V Max 1A
U4 U9 = custom:FP6291: Boost Converter Adjustable 2.6-5.5Vin 12Vout 2A
U5 U7 = custom:STM32_BLUE_PILL